# Altium schematic sheet Assignment 1.SchDoc
size A4
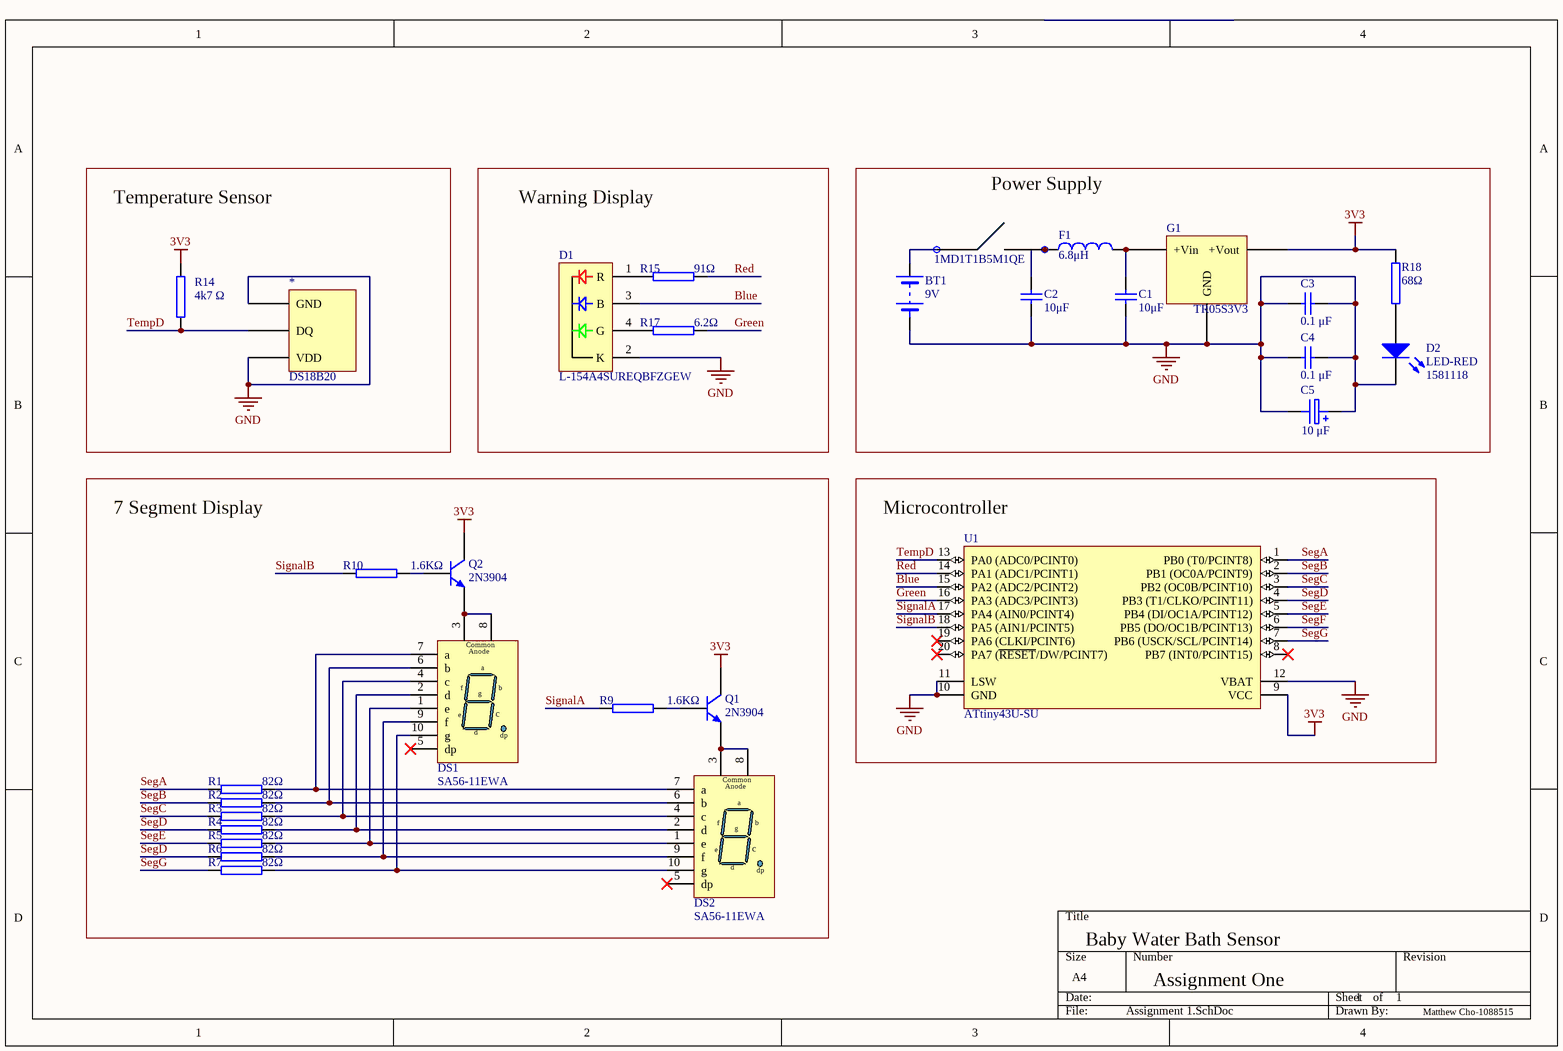
[diagram p0: Assignment 1.SchDoc]

## Parts
*  DS18B20
BT1  9V  [BAT-1_AUT]
C1  10μF  [CAP_0805]
C2  10μF  [CAP_0805]
C3  0.1 μF  [CAP_1210]
C4  0.1 μF  [CAP_1210]
C5  10 μF  [CAPP100-200_AUT]
D1  L-154A4SUREQBFZGEW  [LED 5mm_RGB]
D2  LED-RED  Supplier Part Number 1: 1581118  [LED3MM_R_AUT]
DS1  SA56-11EWA  [DISP-7SEG/14.2_AUT]
DS2  SA56-11EWA  [DISP-7SEG/14.2_AUT]
F1  6.8μH  [0805]
G1  TR05S3V3
P1  1MD1T1B5M1QE
Q1  2N3904  [TO-92AUT]
Q2  2N3904  [TO-92AUT]
R1  82Ω  [AXIAL-0.5AUT]
R2  82Ω  [AXIAL-0.5AUT]
R3  82Ω  [AXIAL-0.5AUT]
R4  82Ω  [AXIAL-0.5AUT]
R5  82Ω  [AXIAL-0.5AUT]
R6  82Ω  [AXIAL-0.5AUT]
R7  82Ω  [AXIAL-0.5AUT]
R9  1.6KΩ  [AXIAL-0.5AUT]
R10  1.6KΩ  [AXIAL-0.5AUT]
R14  4k7 Ω  [AXIAL-0.5AUT]
R15  91Ω  [AXIAL-0.5AUT]
R17  6.2Ω  [AXIAL-0.5AUT]
R18  68Ω  [AXIAL-0.5AUT]
U1  ATtiny43U-SU  [20S2_M]

## Blocks framed on the sheet
Temperature Sensor: * R14
Warning Display: D1 R15 R17
Power Supply: BT1 C1-C5 D2 F1 G1 P1 R18
7 Segment Display: DS1 DS2 Q1 Q2 R1-R7 R9 R10
Microcontroller: U1

## Nets
3V3: G1.4(+Vout) Q1.3(C) Q2.3(C) R14.1 R18.1 U1.9(VCC)
GND: *.3(VDD) *.5(GND) BT1.2 C1.2 C2.2 C3.1 C3.2 C4.1 C4.2 C5.1 C5.2 D1.2(K) D2.K G1.5(GND) U1.10(GND) U1.11(LSW) U1.12(VBAT)
Blue: D1.3(B) U1.15(PA2_(ADC2/PCINT2))
Green: R17.2 U1.16(PA3_(ADC3/PCINT3))
Red: R15.2 U1.14(PA1_(ADC1/PCINT1))
SegA: R1.1 U1.1(PB0_(T0/PCINT8))
SegB: R2.1 U1.2(PB1_(OC0A/PCINT9))
SegC: R3.1 U1.3(PB2_(OC0B/PCINT10))
SegD: R4.1 R6.1 U1.4(PB3_(T1/CLKO/PCINT11))
SegE: R5.1 U1.5(PB4_(DI/OC1A/PCINT12))
SegF: U1.6(PB5_(DO/OC1B/PCINT13))
SegG: R7.1 U1.7(PB6_(USCK/SCL/PCINT14))
SignalA: R9.1 U1.17(PA4_(AIN0/PCINT4))
SignalB: R10.1 U1.18(PA5_(AIN1/PCINT5))
TempD: *.4(DQ) R14.2 U1.13(PA0_(ADC0/PCINT0))
NetBT1_1: BT1.1 P1.0
NetC1_1: C1.1 F1.2 G1.3(+Vin)
NetC2_1: C2.1 F1.1 P1.0
NetD1_1: D1.1(R) R15.1
NetD1_4: D1.4(G) R17.1
NetD2_A: D2.A R18.2
NetDS1_1: DS1.1(e) DS2.1(e) R5.2
NetDS1_2: DS1.2(d) DS2.2(d) R4.2
NetDS1_3: DS1.3(A) DS1.8(A) Q2.1(E)
NetDS1_4: DS1.4(c) DS2.4(c) R3.2
NetDS1_6: DS1.6(b) DS2.6(b) R2.2
NetDS1_7: DS1.7(a) DS2.7(a) R1.2
NetDS1_9: DS1.9(f) DS2.9(f) R6.2
NetDS1_10: DS1.10(g) DS2.10(g) R7.2
NetDS2_3: DS2.3(A) DS2.8(A) Q1.1(E)
NetQ1_2: Q1.2(B) R9.2
NetQ2_2: Q2.2(B) R10.2

Not connected (* = marked no-connect by the designer): DS1 5(dp)*; DS2 5(dp)*; U1 8(PB7_(INT0/PCINT15))* 19(PA6_(CLKI/PCINT6))* 20(PA7_(~{RESET}/DW/PCINT7))*

## Notes on the sheet
- Baby Water Bath Sensor
- Assignment One
- 1
- Matthew Cho-1088515
- (in symbol Display-CA/14.2 (7-Segment Display)) Common; Anode

## Library data of the parts
BT1 = Battery2: Multicell Batterry; ComponentLink1URL: K:\WELLESLEY COPY\DESIGN & CREATIVE TECHNOLOGIES\School of Engineering\Electrical & Electronic Engineering\Resources\AltiumLibaries\Datasheet\Stock Information.pdf; ComponentLink1Description: Stock Information.pdf
C1 C2 = CAPN 0805: Non Polarized Capacitor, SMD, 0805
C3 C4 = CAPN 1210: Non Polarized Capacitor, SMD, 1210
C5 = CAPP100-200: Polarized Aluminum Capacitor, Through Hole, Pitch 100mil, Body 200mil (Dia)
D1 = 5mm LED-RGB: KINGBRIGHT - L-154A4SUREQBFZGEW - LED, MULTICOL., RGB 5MM, X-BRIGHT; Supplier 1: Farnell; Supplier Part Number 1: 2290375
D2 = 3mm LED-RED: 3mm RED LED, Through Hole; Supplier 1: Farnell
DS1 DS2 = Display-CA/14.2 (7-Segment Display): 14.2 mm General Purpose 7-Segment Display: CA, RH DP, Gray Surface.; Supplier 1: Farnell; Supplier 2: Mouser; Supplier Part Number 1: 1142440; Supplier Part Number 2: 604-SA5611EWA
F1 = MLB-201209-0600PN: Choke, 2A,  600ohm at 100MHz; Supplier 1: Farnell; Supplier Part Number 1: 1308783
Q1 Q2 = 2N3904: NPN General Purpose Amplifier, 40v, 200mA, 250MHz; Supplier 1: Farnell; Supplier Part Number 1: 1574370
R1-R7 R9 R10 R14 R15 R17 R18 = Resistor 1/2W: Resistor, Through Hole, Pitch 500mil
U1 = ATtiny43U-SU: 8-bit AVR Microcontroller, 1.8-5.5V, 4KB Flash, 64 Bytes EEPROM, 256 Bytes SRAM, 20-pin SOIC, Industrial Grade (-40°C to 85°C), Pb-Free; Published: 1-Apr-2010; DatasheetVersion: revB, Mar-2009; PackageVersion: revB, Nov-2006; PackageReference: 20S2; Publisher: Altium Limited; PackageDescription: 20-lead, 0.300" Wide Body, Plastic Gull Wing Small Outline Package (SOIC); Supplier 1: Digi-Key; Supplier Part Number 1: ATTINY43U-SU-ND; Supplier 2: Mouser; Supplier Part Number 2: 556-ATTINY43U-SU; Code_JEDEC: MS-013-AC; Code_IPC: SOIC127P1030-20; ComponentLink1Description: Manufacturer Link; ComponentLink1URL: http://www.atmel.com/products/avr/default.asp?; ComponentLink2Description: ATtiny43U Datasheet; ComponentLink2URL: http://www.atmel.com/dyn/resources/prod_documents/doc8048.pdf; ComponentLink3Description: ATtiny43U Summary; ComponentLink3URL: http://www.atmel.com/dyn/resources/prod_documents/8048S.pdf; ComponentLink4Description: Atmel.com Home; ComponentLink4URL: http://www.atmel.com